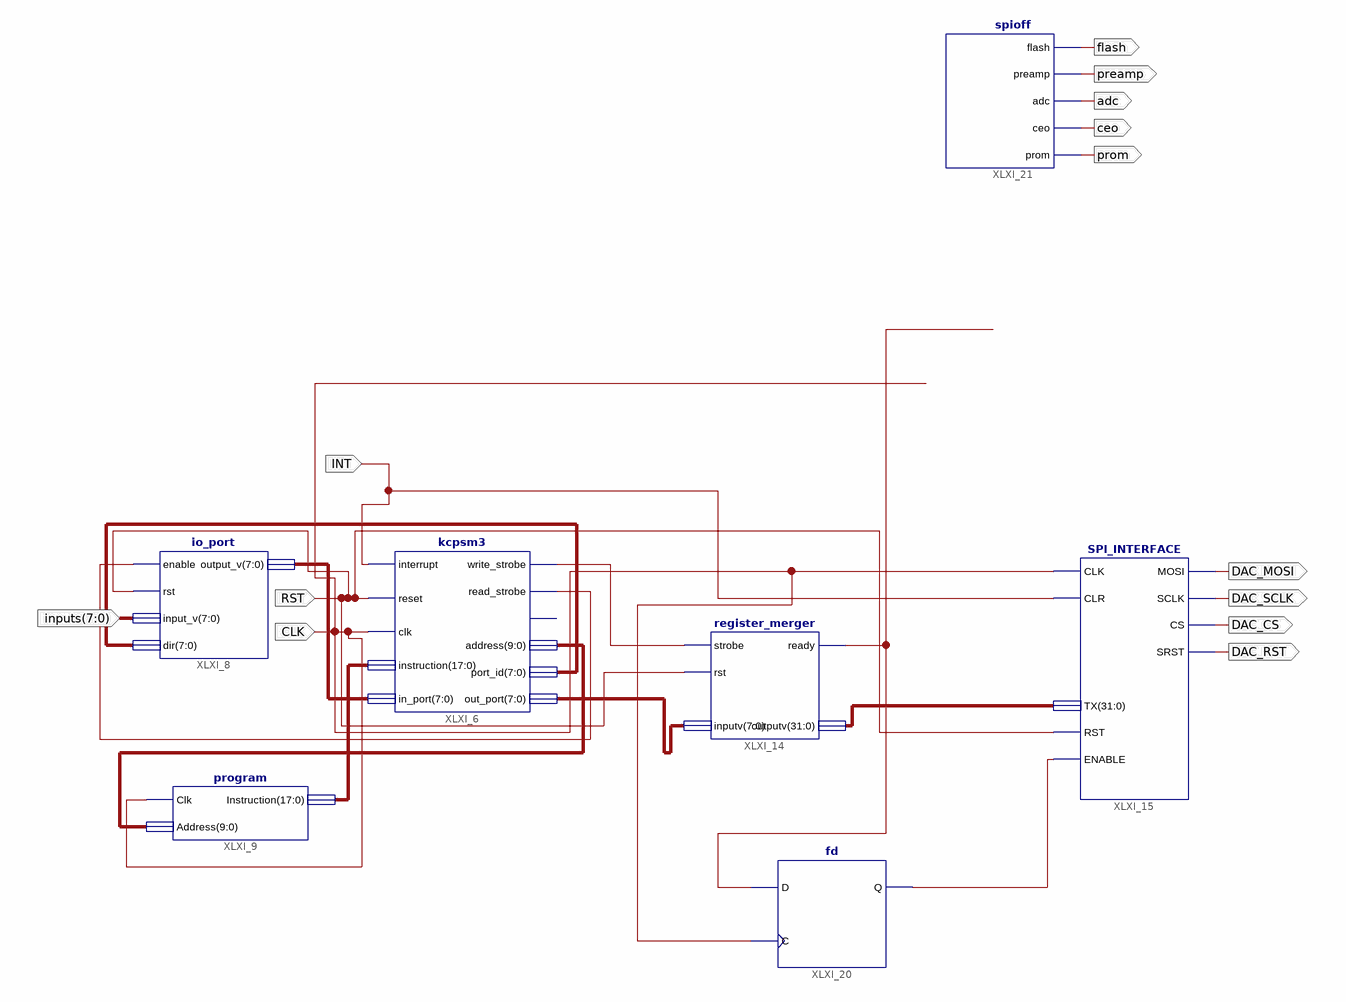
[diagram p0: schematic sheet 1]
// Xilinx ISE schematic todo.sch (spartan3e) as structural Verilog: 7 symbols, 13 ports
module todo (
  input  INT,
  input  RST,
  input  CLK,
  input  [7:0] inputs,
  output DAC_CS,
  output DAC_MOSI,
  output DAC_SCLK,
  output DAC_RST,
  output flash,
  output preamp,
  output adc,
  output ceo,
  output prom
);

  wire WRTSTROBE, XLXN_18, XLXN_551, XLXN_552;
  wire [7:0] XLXN_13, XLXN_16, XLXN_19;
  wire [9:0] XLXN_15;
  wire [17:0] XLXN_14;
  wire [31:0] XLXN_42;

  kcpsm3 XLXI_6 (
    .interrupt(INT), .reset(RST), .clk(CLK), .instruction(XLXN_14), .in_port(XLXN_13),
    .write_strobe(WRTSTROBE), .read_strobe(XLXN_18), .address(XLXN_15), .port_id(XLXN_19), .out_port(XLXN_16));  // open: interrupt_ack
  io_port XLXI_8 (.enable(XLXN_18), .rst(RST), .input_v(inputs), .dir(XLXN_19), .output_v(XLXN_13));
  \program  XLXI_9 (.Clk(CLK), .Address(XLXN_15), .Instruction(XLXN_14));
  register_merger XLXI_14 (.strobe(WRTSTROBE), .rst(RST), .ready(XLXN_552), .inputv(XLXN_16), .outputv(XLXN_42));
  fd XLXI_20 (.C(CLK), .D(XLXN_552), .Q(XLXN_551));
  SPI_INTERFACE XLXI_15 (
    .RST(RST), .ENABLE(XLXN_551), .CLK(CLK), .CLR(INT), .TX(XLXN_42), .MOSI(DAC_MOSI), .SCLK(DAC_SCLK),
    .CS(DAC_CS), .SRST(DAC_RST));
  spioff XLXI_21 (.flash(flash), .preamp(preamp), .adc(adc), .ceo(ceo), .prom(prom));
endmodule
